# EAGLE schematic relay interface (EAGLE 7.1.0)
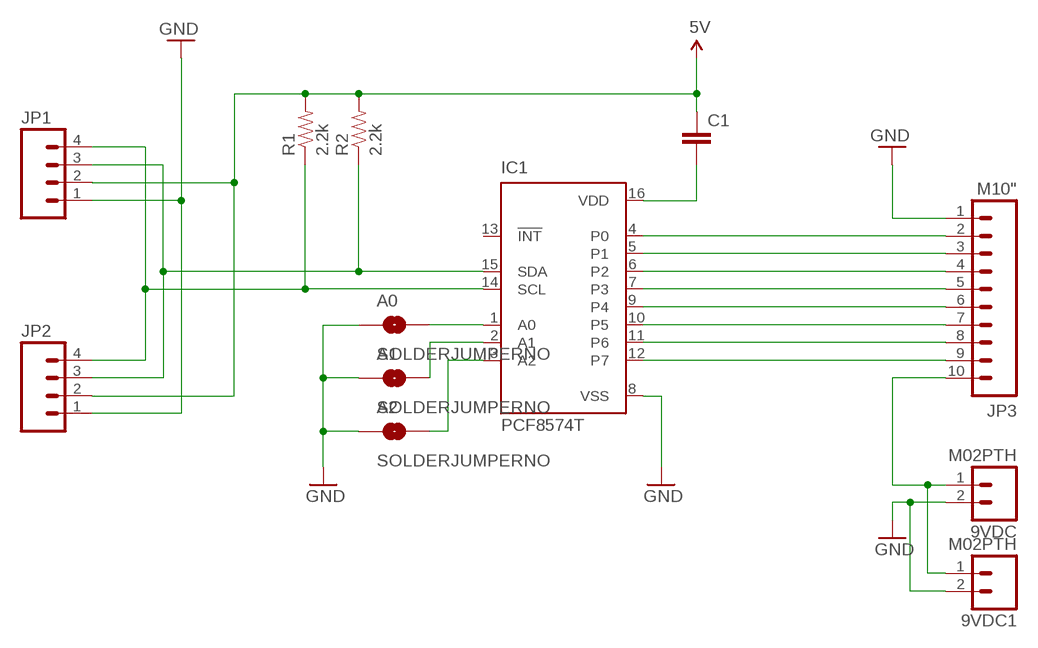
[diagram p0: schematic, sheet 1]

## Parts
9VDC  M02PTH  [1X02]
9VDC1  M02PTH  [1X02]
A0  SOLDERJUMPERNO  [SJ_2S-NO]
A1  SOLDERJUMPERNO  [SJ_2S-NO]
A2  SOLDERJUMPERNO  [SJ_2S-NO]
C1  CAPPTH2  [CAP-PTH-SMALL2]
IC1  PCF8574T  [SO16W]
JP1  M04PTH  [1X04]
JP2  M04PTH  [1X04]
JP3  M10"  [1X10]
R1  2.2k  RESISTORAXIAL-0.3  [AXIAL-0.3]
R2  2.2k  RESISTORAXIAL-0.3  [AXIAL-0.3]

## Nets
5V: C1.1 JP1.2 JP2.2 R1.P$2 R2.P$2
GND: 9VDC1.2 9VDC.2 A0.1 A1.1 A2.1 IC1.8(VSS) JP1.1 JP2.1 JP3.1
N$1: IC1.4(P0) JP3.2
N$2: IC1.5(P1) JP3.3
N$3: IC1.6(P2) JP3.4
N$4: A0.2 IC1.1(A0)
N$5: IC1.14(SCL) JP1.4 JP2.4 R1.P$1
N$6: IC1.15(SDA) JP1.3 JP2.3 R2.P$1
N$7: A1.2 IC1.2(A1)
N$8: C1.2 IC1.16(VDD)
N$9: A2.2 IC1.3(A2)
N$10: IC1.7(P3) JP3.5
N$11: IC1.9(P4) JP3.6
N$12: IC1.10(P5) JP3.7
N$13: IC1.11(P6) JP3.8
N$14: IC1.12(P7) JP3.9
N$15: 9VDC1.1 9VDC.1 JP3.10
Unconnected: IC1.13(!INT)

## Library data of the parts
9VDC 9VDC1 = SparkFun-Connectors:M02: Standard 2-pin 0.1" header. Use with - straight break away headers ( PRT-00116) - right angle break away headers (PRT-00553) - swiss pins (PRT-00743) - machine pins (PRT-00117) - female headers (PRT-00115) Molex polarized connector foot print use with: PRT-08233 with associated crimp pins and housings. 2.54_SCREWTERM for use with PRT-10571. 3.5mm Screw Terminal footprints for PRT-08084 5mm Screw Terminal footprints for use with PRT-08432
A0 A1 A2 = SparkFun-Retired:SOLDERJUMPER: Solder Jumper Standard SMD solder jumper. Used to automate production. Two varients : Normally Open and Normally Closed are the same, but have different paste layers. NC will have a large amount of paste and should jumper during reflow.
C1 = SparkFun-Capacitors:CAP: Capacitor Standard 0603 ceramic capacitor, and 0.1" leaded capacitor.
IC1 = micro-philips:PCF8574: I2C-Bus Remote 8-bit I/O expander http://www.semiconductors.philips.com/acrobat_download/datasheets/PCF8574_4.pdf
JP1 JP2 = SparkFun-Connectors:M04: Header 4 Standard 4-pin 0.1" header. Use with straight break away headers (SKU : PRT-00116), right angle break away headers (PRT-00553), swiss pins (PRT-00743), machine pins (PRT-00117), and female headers (PRT-00115). Molex polarized connector foot print use with SKU : PRT-08231 with associated crimp pins and housings. 1MM SMD Version SKU: PRT-10208
JP3 = SparkFun-Connectors:M10: Header 10 Standard 10-pin 0.1" header. Use with straight break away headers (SKU : PRT-00116), right angle break away headers (PRT-00553), swiss pins (PRT-00743), machine pins (PRT-00117), and female headers (PRT-00115).
R1 R2 = SparkFun-Resistors:RESISTOR: Resistor Basic schematic elements and footprints for 0603, 1206, and PTH resistors.